# EAGLE schematic cansat_Pony_ser_ICSP (EAGLE 7.1.0)
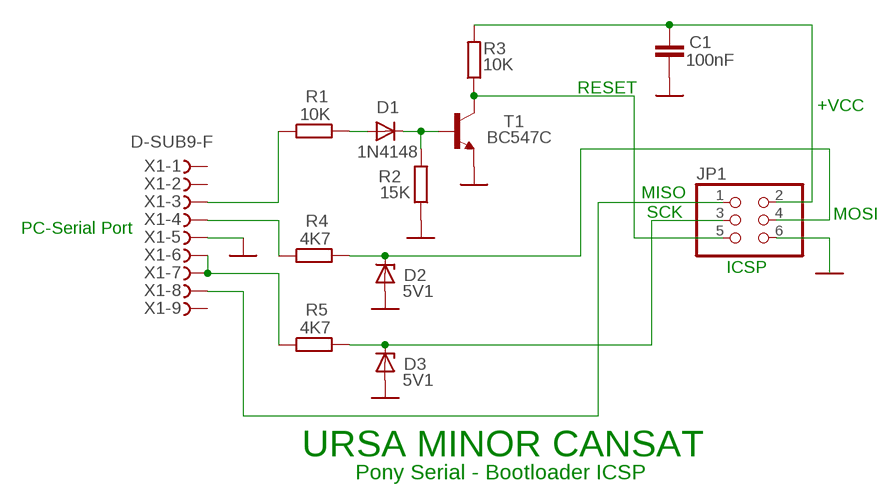
[diagram p0: schematic, sheet 1]

## Parts
C1  100nF  C2.5/2  [C2.5-2]
D1  1N4148  1N4148DO35-10  [DO35-10]
D2  5V1  BZD23  [SOD81]
D3  5V1  BZD23  [SOD81]
JP1  PINHD-2X3  [2X03]
R1  10K  R-EU_0204_2V  [0204V]
R2  15K  R-EU_0204_2V  [0204V]
R3  10K  R-EU_0204_2V  [0204V]
R4  4K7  R-EU_0204_2V  [0204V]
R5  4K7  R-EU_0204_2V  [0204V]
T1  BC547C  BC547B-NPN-TO92-CBE  [TO92-CBE]
X1  D-SUB9-F  D-SUB9-H2M09RA  [H2M09RA]

## Nets
GND: C1.2 D2.A D3.A R2.1 T1.E X1.5
N$1: JP1.5 R3.1 T1.C
N$2: C1.1 JP1.2 R3.2
N$3: JP1.6
N$4: JP1.1 X1.8
N$5: R1.1 X1.3
N$49: D1.A R1.2
N$50: D1.C R2.2 T1.B
N$51: R4.1 X1.4
N$52: D2.C JP1.4 R4.2
N$53: R5.1 X1.6 X1.7
N$54: D3.C JP1.3 R5.2
Unconnected: X1.1 X1.2 X1.9

## Notes on the sheet
- RESET
- +VCC
- MISO
- SCK | MOSI
- PC-Serial Port
- ICSP
- URSA MINOR CANSAT
- Pony Serial - Bootloader ICSP

## Library data of the parts
C1 = capacitor-wima:C: CAPACITOR naming: grid - package width
D1 = diode:1N4148: DIODE high speed (Philips)
D2 D3 = diode:BZD23: Z DIODE
JP1 = pinhead:PINHD-2X3: PIN HEADER
R1-R5 = resistor:R-EU_: RESISTOR, European symbol; SPICEPREFIX: R
T1 = transistor:*-NPN-: NPN Transistror BF959 corrected 2008.03.06
X1 = con-thomas-betts:D-SUB9-: D-Subminiatur Connector Source: Electronioc Interconnects European Edition 1998; OC_FARNELL: unknown; OC_NEWARK: unknown